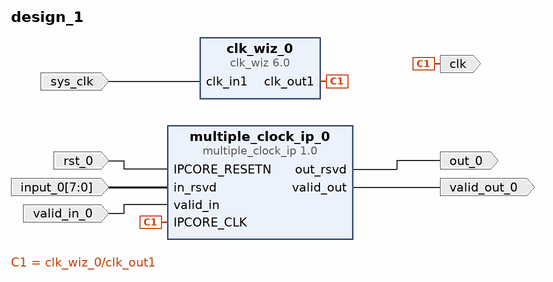
[diagram p0: block diagram of the top level]
# Vivado block design design_1, xc7z010clg400-1, Vivado 2023.2
create_bd_design design_1

create_bd_port -dir O valid_out_0
create_bd_port -dir O out_0
create_bd_port -dir I valid_in_0
create_bd_port -dir I -from 7 -to 0 input_0
create_bd_port -dir I -type clk sys_clk
create_bd_port -dir O -type clk clk
create_bd_port -dir I -type rst rst_0

create_bd_cell -type ip -vlnv user.org:ip:multiple_clock_ip:1.0 multiple_clock_ip_0
create_bd_cell -type ip -vlnv xilinx.com:ip:clk_wiz:6.0 clk_wiz_0
set_property -dict {CONFIG.USE_LOCKED false CONFIG.USE_RESET false} [get_bd_cells clk_wiz_0]

# ---- connections ----

connect_bd_net -net IPCORE_RESETN_0_1 [get_bd_ports rst_0] [get_bd_pins multiple_clock_ip_0/IPCORE_RESETN]
connect_bd_net -net clk_in1_0_1 [get_bd_ports sys_clk] [get_bd_pins clk_wiz_0/clk_in1]
connect_bd_net [get_bd_pins clk_wiz_0/clk_out1] [get_bd_pins multiple_clock_ip_0/IPCORE_CLK] [get_bd_ports clk]
connect_bd_net -net in_rsvd_0_1 [get_bd_ports input_0] [get_bd_pins multiple_clock_ip_0/in_rsvd]
connect_bd_net [get_bd_pins multiple_clock_ip_0/out_rsvd] [get_bd_ports out_0]
connect_bd_net [get_bd_pins multiple_clock_ip_0/valid_out] [get_bd_ports valid_out_0]
connect_bd_net -net valid_in_0_1 [get_bd_ports valid_in_0] [get_bd_pins multiple_clock_ip_0/valid_in]

validate_bd_design
save_bd_design
